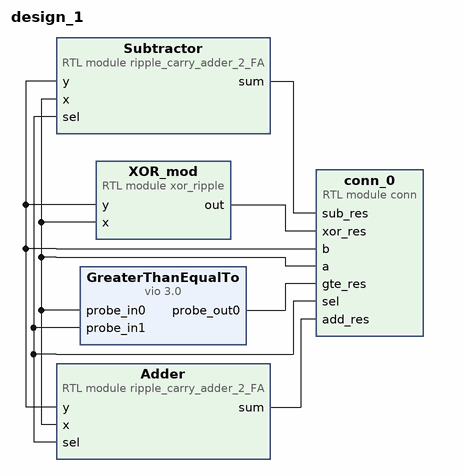
[diagram p0: block diagram of the top level]
# Vivado block design design_1, xcku5p-ffvb676-2-e, Vivado 2018.3
create_bd_design design_1

create_bd_cell -type module -reference ripple_carry_adder_2_FA Adder
create_bd_cell -type module -reference ripple_carry_adder_2_FA Subtractor
create_bd_cell -type module -reference xor_ripple XOR_mod
create_bd_cell -type module -reference conn conn_0
create_bd_cell -type ip -vlnv xilinx.com:ip:vio:3.0 GreaterThanEqualTo
set_property -dict {CONFIG.C_NUM_PROBE_IN 2} [get_bd_cells GreaterThanEqualTo]

# ---- connections ----

connect_bd_net [get_bd_pins Adder/sum] [get_bd_pins conn_0/add_res]
connect_bd_net [get_bd_pins XOR_mod/out] [get_bd_pins conn_0/xor_res]
connect_bd_net [get_bd_pins Subtractor/sum] [get_bd_pins conn_0/sub_res]
connect_bd_net [get_bd_pins conn_0/a] \
  [get_bd_pins Adder/x] [get_bd_pins XOR_mod/x] [get_bd_pins Subtractor/x] [get_bd_pins GreaterThanEqualTo/probe_in0]
connect_bd_net [get_bd_pins Adder/y] [get_bd_pins conn_0/b] [get_bd_pins XOR_mod/y] [get_bd_pins Subtractor/y]
connect_bd_net [get_bd_pins Adder/sel] [get_bd_pins conn_0/sel] [get_bd_pins Subtractor/sel] [get_bd_pins GreaterThanEqualTo/probe_in1]
connect_bd_net [get_bd_pins GreaterThanEqualTo/probe_out0] [get_bd_pins conn_0/gte_res]

validate_bd_design
save_bd_design
